# Altium schematic sheet HMD.schdoc
size 235 x 162 mm
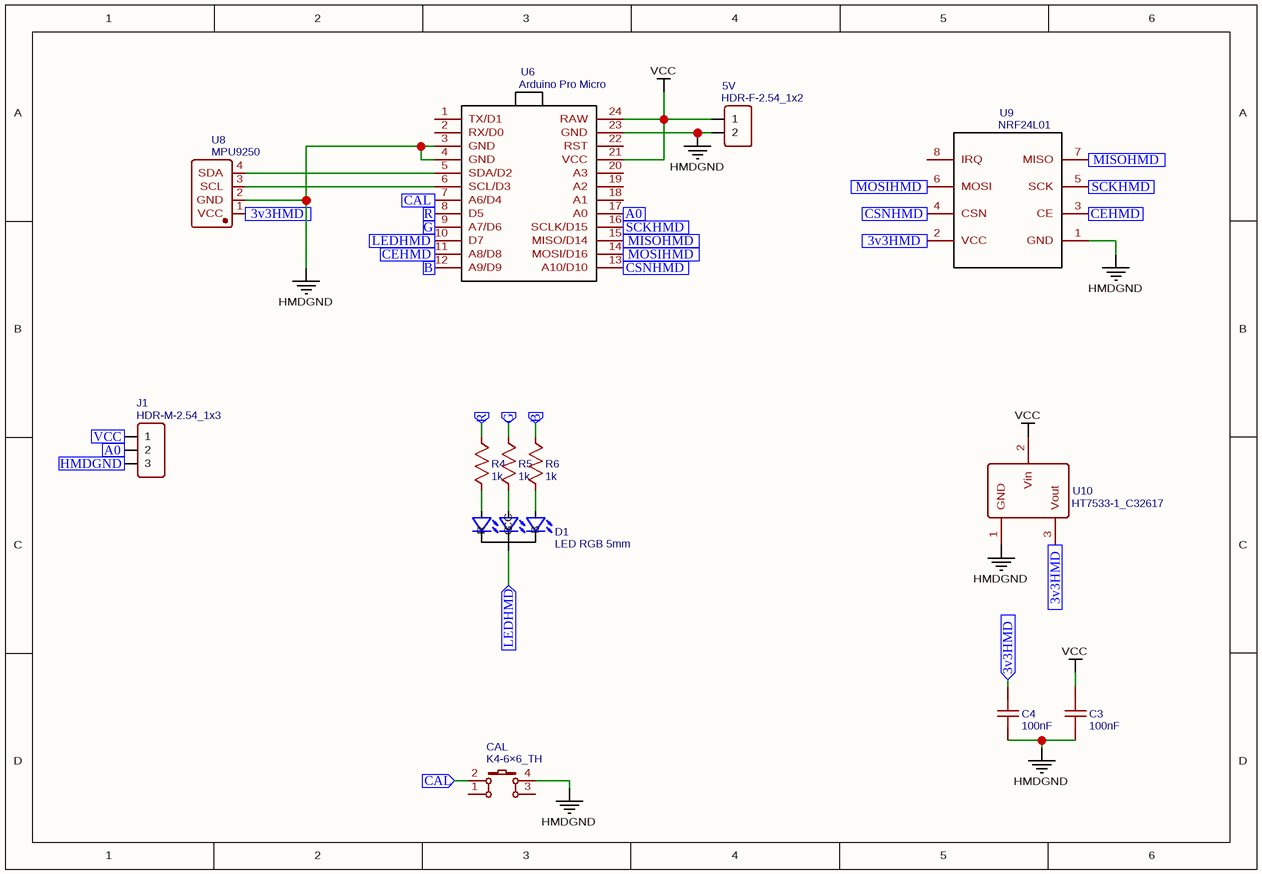
[diagram p0: HMD.schdoc]

## Parts
5V  HDR-F-2.54_1x2  [HDR-F-2.54_1X2]
C3  100nF  [RAD-0.1]
C4  100nF  [RAD-0.1]
CAL  K4-6×6_TH  [KEY-TH_4P-L6.0-W6.0-P4.50-LS6.5]
D1  LED RGB 5mm  [LED_RGB_5MM]
J1  HDR-M-2.54_1x3  [HDR-M-2.54_1X3]
R4  1k  [R_AXIAL-0.3]
R5  1k  [R_AXIAL-0.3]
R6  1k  [R_AXIAL-0.3]
U6  Arduino Pro Micro  [ARDUINO_PRO_MICRO]
U8  MPU9250  [MPU9250]
U9  NRF24L01  [MOD-NRF24L01]
U10  HT7533-1_C32617  [TO-92-3_L4.9-W3.7-P1.27-L]

## Ports
3v3HMD (in), A0 (in), B (in), CAL (in), CEHMD (in), CSNHMD (in), G (in), HMDGND (in), LEDHMD (in), MISOHMD (in), MOSIHMD (in), R (in), SCKHMD (in), VCC (in)

## Nets
HMDGND: 5V.2 C3.1 C4.1 CAL.4 U6.3(GND) U6.4(GND) U6.23(GND) U8.2(GND) U9.1(GND) U10.1(GND)
VCC: 5V.1 C3.2 U6.21(VCC) U6.24(RAW) U10.2(Vin)
3v3HMD: C4.2 U8.1(VCC) U9.2(VCC) U10.3(Vout) ; port 3v3HMD
A0: J1.2 U6.17(A0) ; port A0
B: R6.2 U6.12(A9/D9) ; port B
CAL: CAL.2 U6.7(A6/D4) ; port CAL
CEHMD: U6.11(A8/D8) U9.3(CE) ; port CEHMD
CSNHMD: U6.13(A10/D10) U9.4(CSN) ; port CSNHMD
G: R5.2 U6.9(A7/D6) ; port G
HMDGND: J1.3 ; port HMDGND  [a separate net that carries the same name]
LEDHMD: D1.2(CC) U6.10(D7) ; port LEDHMD
MISOHMD: U6.15(MISO/D14) U9.7(MISO) ; port MISOHMD
MOSIHMD: U6.14(MOSI/D16) U9.6(MOSI) ; port MOSIHMD
R: R4.2 U6.8(D5) ; port R
SCKHMD: U6.16(SCLK/D15) U9.5(SCK) ; port SCKHMD
VCC: J1.1 ; port VCC  [a separate net that carries the same name]
NetD1_1: D1.1(R) R4.1
NetD1_3: D1.3(G) R5.1
NetD1_4: D1.4(B) R6.1
NetU6_5: U6.5(SDA/D2) U8.4(SDA)
NetU6_6: U6.6(SCL/D3) U8.3(SCL)

Not connected (* = marked no-connect by the designer): CAL 1 3; U6 1(TX/D1) 2(RX/D0) 18(A1) 19(A2) 20(A3) 22(RST); U9 8(IRQ)

## Library data of the parts
5V = HDR-F-2.54_1x2: Contributor: LCEDA_Lib; BOM_Supplier Part: C49661; BOM_Supplier: LCSC; spicePre: H; spiceSymbolName: HDR-F-2.54_1x2
C3 C4 = 100nF: nameAlias: Value(F); Contributor: LCEDA_Lib; spicePre: C; spiceSymbolName: C_RAD-0.2_US
CAL = K4-6×6_TH: BOM_Manufacturer: 韩国韩荣; BOM_Manufacturer Part: K2-1102DP-E4SW-04; Contributor: LCEDA_Lib; BOM_Supplier: LCSC; BOM_Supplier Part: C136684; spicePre: K; spiceSymbolName: K4-6×6_TH
D1 = LED RGB 5mm: BOM_Manufacturer: Togialed; BOM_Manufacturer Part: TJ-L5FYTXHMCSLCRGB-A5; Contributor: PedroM; BOM_Supplier: LCSC; BOM_Supplier Part: C330759; link: https://lcsc.com/product-detail/Others_TOGIALED-TJ-L5FYTXHMCSLCRGB-A5_C330759.html?ref=editor&logined=true; spicePre: D; spiceSymbolName: LED RGB 5mm
J1 = HDR-M-2.54_1x3: Contributor: LCEDA_Lib; BOM_Supplier Part: C180248; BOM_Supplier: LCSC; spicePre: J; spiceSymbolName: HDR-M-2.54_1x3
R4-R6 = 1k: nameAlias: Value(Ω); Contributor: LCEDA_Lib; spicePre: R; spiceSymbolName: R_AXIAL-0.3_US
U6 = Arduino Pro Micro: Contributor: gatoloco65; BOM_Manufacturer Part: Arduino Pro Micro; spicePre: U; spiceSymbolName: Arduino Pro Micro
U8 = MPU9250: Contributor: Виктор Семинченко; spicePre: U; spiceSymbolName: MPU9250
U9 = NRF24L01: Contributor: NukeLeo; BOM_Manufacturer Part: NRF24L01; spicePre: U; spiceSymbolName: NRF24L01
U10 = HT7533-1_C32617: BOM_Manufacturer: HOLTEK; SMT Type: Extend; BOM_Paste Type: expand; BOM_Supplier: LCSC; BOM_Manufacturer Part: HT7533-1; image: //image.lceda.cn/szlcsc/C32617.jpg; BOM_Supplier Part: C32617; BOM_LCSC Assembly: Yes; spicePre: U; spiceSymbolName: HT7533-1_C32617